# EAGLE design roboskin_distance_IMU_WIFI (EAGLE 9.4.2)
COMPANY: ADAFRUIT INDUSTRIES; DRAWN: KTOWN; REV: B
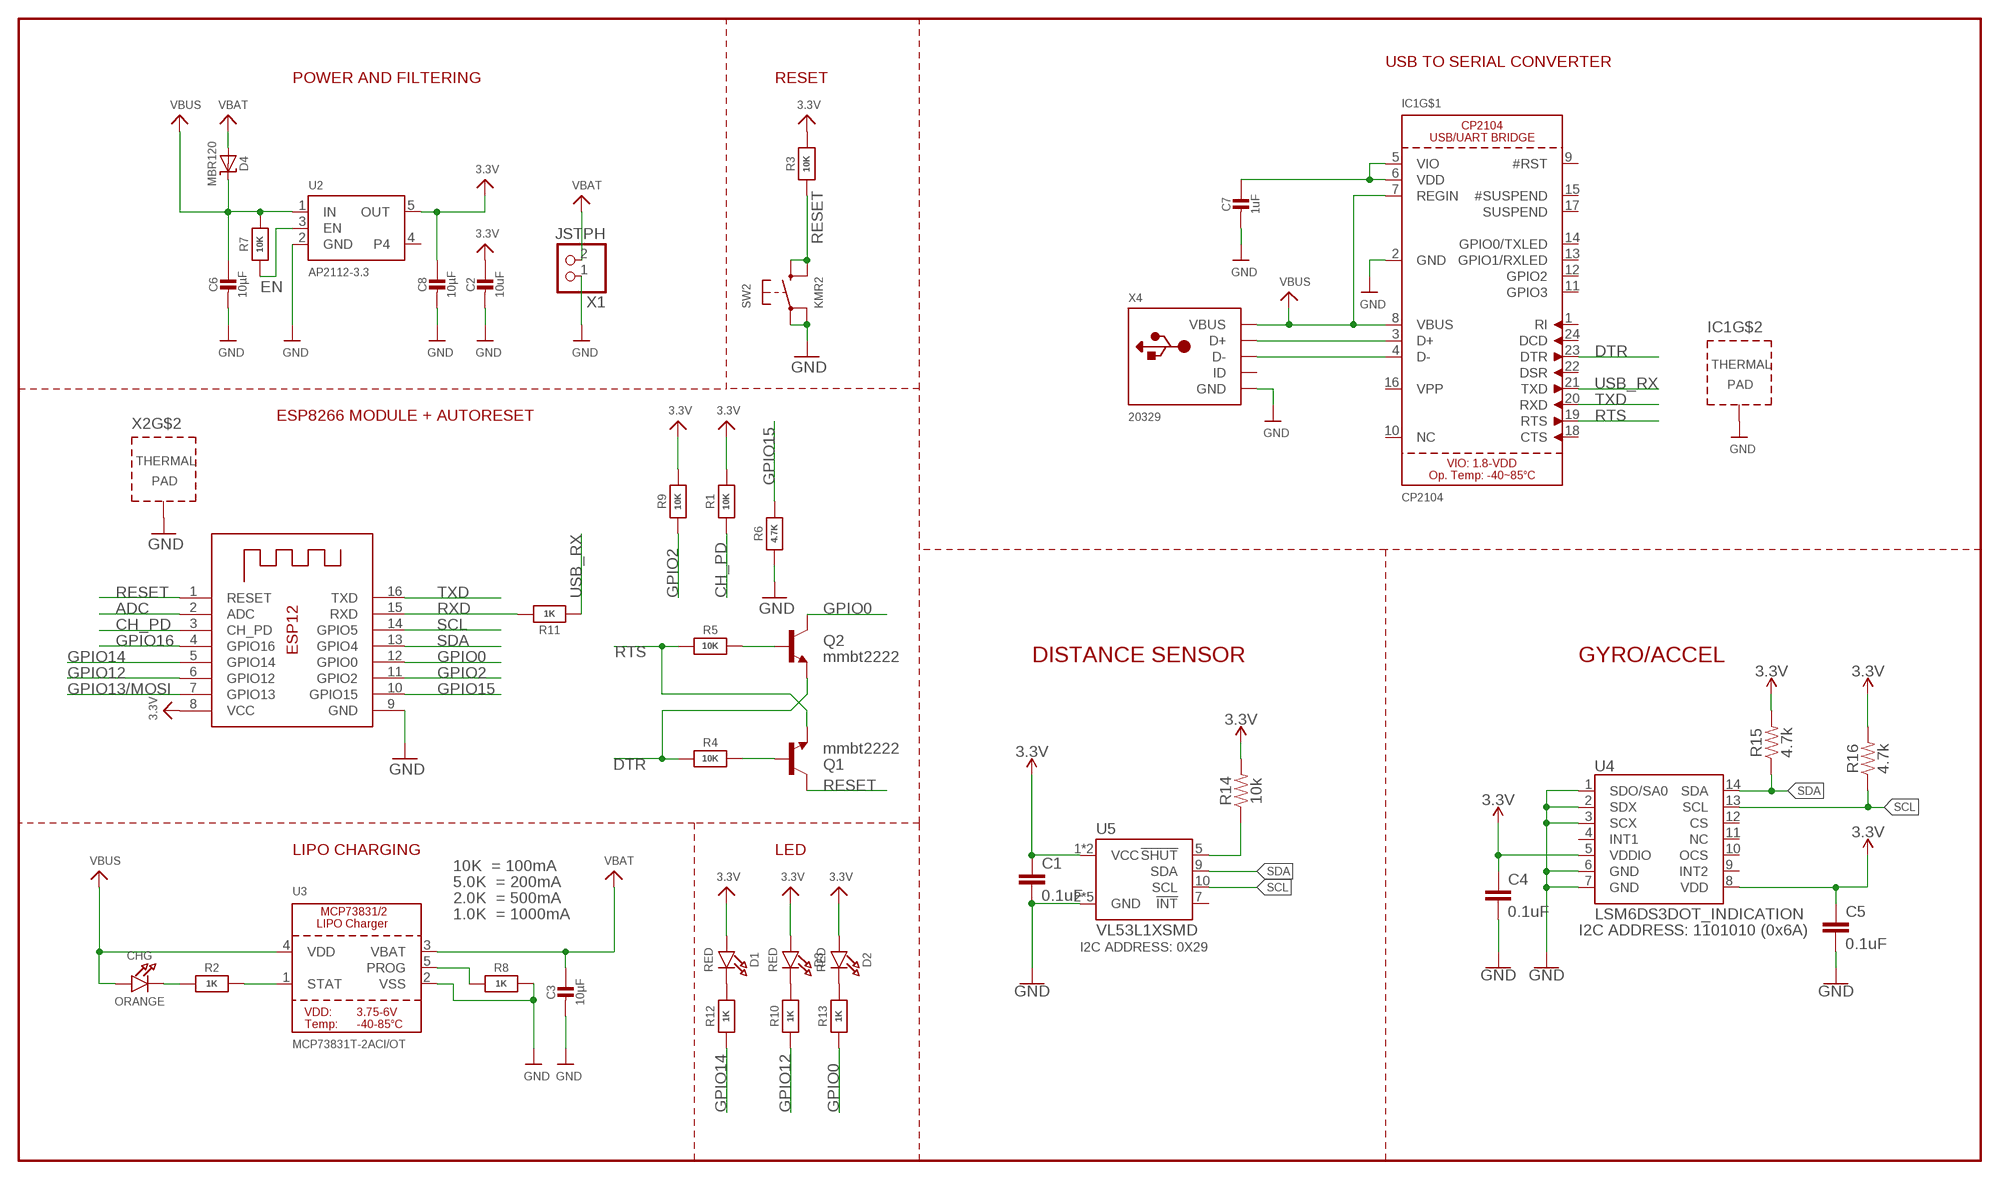
[diagram p0: schematic, sheet 1]

## Parts
C1  0.1uF  0.1UF-0603-25V-(+80/-20%)  [0603]
C2  10uF  CAP_CERAMIC0805-NOOUTLINE  [0805-NO]
C3  10µF  CAP_CERAMIC0805-NOOUTLINE  [0805-NO]
C4  0.1uF  0.1UF-0603-25V-(+80/-20%)  [0603]
C5  0.1uF  0.1UF-0603-25V-(+80/-20%)  [0603]
C6  10µF  CAP_CERAMIC0805-NOOUTLINE  [0805-NO]
C7  1uF  CAP_CERAMIC0603_NO  [0603-NO]
C8  10µF  CAP_CERAMIC0805-NOOUTLINE  [0805-NO]
CHG  ORANGE  LED0805_NOOUTLINE  [CHIPLED_0805_NOOUTLINE]
D1  RED  LED0805_NOOUTLINE  [CHIPLED_0805_NOOUTLINE]
D2  RED  LED0805_NOOUTLINE  [CHIPLED_0805_NOOUTLINE]
D3  RED  LED0805_NOOUTLINE  [CHIPLED_0805_NOOUTLINE]
D4  MBR120  DIODE-SCHOTTKYSOD-123  [SOD-123]
IC1  CP2104  [QFN24_4MM_SMSC]
Q1  mmbt2222  TRANSISTOR_NPNSOT23-3  [SOT23-3]
Q2  mmbt2222  TRANSISTOR_NPNSOT23-3  [SOT23-3]
R1  10K  RESISTOR_0603_NOOUT  [0603-NO]
R2  1K  RESISTOR_0603_NOOUT  [0603-NO]
R3  10K  RESISTOR_0603_NOOUT  [0603-NO]
R4  10K  RESISTOR_0603_NOOUT  [0603-NO]
R5  10K  RESISTOR_0603_NOOUT  [0603-NO]
R6  4.7K  RESISTOR_0603_NOOUT  [0603-NO]
R7  10K  RESISTOR_0603_NOOUT  [0603-NO]
R8  1K  RESISTOR_0603_NOOUT  [0603-NO]
R9  10K  RESISTOR_0603_NOOUT  [0603-NO]
R10  1K  RESISTOR_0603_NOOUT  [0603-NO]
R11  1K  RESISTOR_0603MP  [_0603MP]
R12  1K  RESISTOR_0603_NOOUT  [0603-NO]
R13  1K  RESISTOR_0603_NOOUT  [0603-NO]
R14  10k  10KOHM-0603-1/10W-1%  [0603]
R15  4.7k  4.7KOHM-0603-1/10W-1%  [0603]
R16  4.7k  4.7KOHM-0603-1/10W-1%  [0603]
SW2  KMR2  SWITCH_TACT_SMT4.6X2.8  [BTN_KMR2_4.6X2.8]
U2  AP2112-3.3  VREG_SOT23-5  [SOT23-5]
U3  MCP73831T-2ACI/OT  MCP73831/2  [SOT23-5]
U4  LSM6DS3DOT_INDICATION  [LGA14L_DOT_INDICATOR]
U5  VL53L1XSMD  [VL53L1X]
X1  JSTPH  CON_JST_PH_2PIN  [JSTPH2]
X2  ESP-12  ESP-12S  [ESP-12S]
X4  20329  USB_MICRO_20329_V2  [4UCONN_20329_V2]

## Nets
3.3V: C1.1 C2.1 C4.1 C8.1 D1.A D2.A D3.A R1.2 R3.2 R9.2 R14.2 R15.2 R16.2 U2.5(OUT) U4.5(VDDIO) U5.1(VCC) U5.11(VCC) X2.8(VCC)
ADC: X2.2(ADC)
CH_PD: R1.1 X2.3(CH_PD)
DTR: IC1.23(DTR) Q2.2(E) R4.1
EN: R7.1 U2.3(EN)
GND: C1.2 C2.2 C3.2 C4.2 C5.2 C6.2 C7.2 C8.2 IC1.2(GND) IC1.THERM(TP) R6.1 R8.2 SW2.A'(P1) SW2.A(P) U2.2(GND) U3.2(VSS) U4.1(SDO/SA0) U4.2(SDX) U4.3(SCX) U4.6(GND) U4.7(GND) U5.2(GND) U5.3(GND) U5.4(GND) U5.6(GND) U5.12(GND) X1.1 X2.9(GND) X2.P$1(TP) X4.BASE@1(GND) X4.BASE@2(GND) X4.GND X4.SPRT@1(GND) X4.SPRT@2(GND) X4.SPRT@3(GND) X4.SPRT@4(GND)
GPIO0: Q2.3(C) R13.1 X2.12(GPIO0)
GPIO2: R9.1 X2.11(GPIO2)
GPIO12: R10.1 X2.6(GPIO12)
GPIO13/MOSI: X2.7(GPIO13)
GPIO14: R12.1 X2.5(GPIO14)
GPIO15: R6.2 X2.10(GPIO15)
GPIO16: X2.4(GPIO16)
N$1: CHG.C R2.1
N$2: IC1.3(D+) X4.D+
N$3: R2.2 U3.1(STAT)
N$4: R8.1 U3.5(PROG)
N$5: D3.C R10.2
N$6: IC1.4(D-) X4.D-
N$8: C7.1 IC1.5(VIO) IC1.6(VDD)
N$9: D1.C R12.2
N$10: D2.C R13.2
N$11: R14.1 U5.5(!SHUT)
N$12: Q1.1(B) R4.2
N$13: Q2.1(B) R5.2
N$14: C5.1 U4.8(VDD) ; supply symbol labelled 3.3V
RESET: Q1.3(C) R3.1 SW2.B'(S1) SW2.B(S) X2.1(RESET)
RTS: IC1.19(RTS) Q1.2(E) R5.1
RXD: R11.2 X2.15(RXD)
SCL: R16.1 U4.13(SCL) U5.10(SCL) X2.14(GPIO5)
SDA: R15.1 U4.14(SDA) U5.9(SDA) X2.13(GPIO4)
TXD: IC1.20(RXD) X2.16(TXD)
USB_RX: IC1.21(TXD) R11.1
VBAT: C3.1 D4.A U3.3(VBAT) X1.2
VBUS: C6.1 CHG.A D4.C IC1.7(REGIN) IC1.8(VBUS) R7.2 U2.1(IN) U3.4(VDD) X4.VBUS
Unconnected: IC1.1(RI) IC1.9(#RST) IC1.10(NC) IC1.11(GPIO3) IC1.12(GPIO2) IC1.13(GPIO1/RXLED) IC1.14(GPIO0/TXLED) IC1.15(#SUSPEND) IC1.16(VPP) IC1.17(SUSPEND) IC1.18(CTS) IC1.22(DSR) IC1.24(DCD) U2.4 U4.4(INT1) U4.9(INT2) U4.10(OCS) U4.11(NC) U4.12(CS) U5.7(!INT) X4.ID

## Notes on the sheet
- USB TO SERIAL CONVERTER
- POWER AND FILTERING | RESET
- ESP8266 MODULE + AUTORESET
- DISTANCE SENSOR | GYRO/ACCEL
- LIPO CHARGING | LED
- 10K  = 100mA
- 5.0K  = 200mA
- 2.0K  = 500mA
- 1.0K  = 1000mA
- I2C ADDRESS: 1101010 (0x6A)
- I2C ADDRESS: 0X29

## Library data of the parts
C1 C4 C5 = SparkFun-Capacitors:0.1UF: 0.1µF ceramic capacitors A capacitor is a passive two-terminal electrical component used to store electrical energy temporarily in an electric field.; PROD_ID: CAP-00810
C2 C3 C6-C8 = microbuilder:CAP_CERAMIC: Ceramic Capacitors For new designs, use the packages preceded by an '_' character since they are more reliable: The following footprints should be used on most boards: _0402 - Standard footprint for regular board layouts _0603 - Standard footprint for regular board layouts _0805 - Standard footprint for regular board layouts _1206 - Standard footprint for regular board layouts For extremely tight-pitch boards where space is at a premium, the following 'micro-pitch' footprints can be used (smaller pads, no silkscreen outline, etc.): _0402MP - Micro-pitch footprint for very dense/compact boards _0603MP - Micro-pitch footprint for very dense/compact boards _0805MP - Micro-pitch footprint for very dense/compact boards _1206MP - Micro-pitch footprint for very dense/compact boards
CHG D1-D3 = microbuilder:LED: LED 0603 - 0603 Surface Mount Package 2mA: Green LED - Low Power (3.9mcd, 2ma, 1.7Vf) - Digikey: 475-2709-2-ND Orange LED - Low Power (9.8mcd, 2ma, 1.8Vf) - Digikey: 475-1194-2-ND Red LED - Low Power (5mcd, 2ma, 1.8Vf) - Digikey: 475-1195-2-ND Yellow LED - Low Power (7mcd, 2ma, 1.8Vf) - Digikey: 475-1196-2-ND 5mA: Blue LED - Low Power (17mcd, 5ma, 2.9Vf) - Digikey: LNJ937W8CRACT-ND 0805 - 0805 Surface Mount Package 2mA: Red LED (8.8mcd, 2mA, 1.8Vf, Clear) - Low Power [Digikey: 475-2510-1-ND] Green LED (5mcd, 2mA, 1.8Vf, Clear) - Low Power [Digikey: 475-2730-1-ND] Yellow LED (11.3mcd, 2mA, 1.8Vf, Clear) - Low Power [Digikey: 475-2555-1-ND] 20mA: Red LED (104mcd, 20mA, Diffused) - LS R976 [Digikey: 475-1278-6-ND] Red LED (12mcd, 20mA, 2.0Vf, Clear) - APT2012EC [Digikey: 754-1128-1-ND] Green LED (15mcd, 20mA, 2.2Vf, Clear) - APT2012GC [Digikey: 754-1131-1-ND] Orange LED (160mcd, 20mA, 2.1Vf, Clear) - APT2012SECK [Digikey: 754-1130-1-ND] 1206 - 1206 Surface Mount Package Green LED (26mcd, 20mA, Diffused) - LG N971 [Digikey: 475-1407-6-ND] Red LED (15mcd, 20mA, Diffused) - LH N974 [Digikey: 475-1416-6-ND] Cree - Cree High-Power Surface Mount LEDs XPEBWT-L1-0000-00D50 - White 111lm 350mA 2.9Vf 6200K 110° XTEAWT-00-0000-00000LEE3 - White 114lm 350mA 2.85Vf 5000K 115° Everlight - Everlight 45-21 Series Surface Mount LEDs 45-21/QK2C-B2832AC2CB2/2T - Warm White 2000mcd 20mA 3.25Vf 3050K 120° 45-21/LK2C-B38452C4CB2/2T - Nuetral White 2000mcd 20mA 3.25Vf 4150K 120° 45-21/LK2C-B50634C6CB2/2T - Cold White 2200mcd 20mA 3.25Vf 5650K 120° PLCC2 Reverse Mount LS T77K-J1L2-1-0-2-R18-Z - Red 11.25mcd 2mA 1.8Vf 630nm 120° LO T77K-L1M2-24-Z - Orange 19.6mcd 2mA 1.8Vf 606nm 120° LY T77K-K2M1-26-Z - Yellow 15.7mcd 2mA 1.8Vf 587nm 120°
D4 = microbuilder:DIODE-SCHOTTKY
IC1 = microbuilder:CP2104: CP2104 - USB to UART Bridge VDD Output: 3.45V
Q1 Q2 = SparkFun:TRANSISTOR_NPN: Transistor NPN BJT configuration in SOT23 package. MMBT2222 is the common NPN we use. Double check BCE configuration again layout.
R1-R13 = microbuilder:RESISTOR: Resistors For new designs, use the packages preceded by an '_' character since they are more reliable: The following footprints should be used on most boards: _0402 - Standard footprint for regular board layouts _0603 - Standard footprint for regular board layouts _0805 - Standard footprint for regular board layouts _1206 - Standard footprint for regular board layouts For extremely tight-pitch boards where space is at a premium, the following 'micro-pitch' footprints can be used (smaller pads, no silkscreen outline, etc.): _0402MP - Micro-pitch footprint for very dense/compact boards _0603MP - Micro-pitch footprint for very dense/compact boards _0805MP - Micro-pitch footprint for very dense/compact boards _1206MP - Micro-pitch footprint for very dense/compact boards
R14 = SparkFun-Resistors:10KOHM: 10kΩ resistor A resistor is a passive two-terminal electrical component that implements electrical resistance as a circuit element. Resistors act to reduce current flow, and, at the same time, act to lower voltage levels within circuits. - Wikipedia; PROD_ID: RES-00824
R15 R16 = SparkFun-Resistors:4.7KOHM: 4.7kΩ resistor A resistor is a passive two-terminal electrical component that implements electrical resistance as a circuit element. Resistors act to reduce current flow, and, at the same time, act to lower voltage levels within circuits. - Wikipedia; PROD_ID: RES-07857
SW2 = microbuilder:SWITCH_TACT_SMT: SMT Tact Switches 6x6mm - Digikey: P12940SCT-ND KMR2 (4.6x2.8mm) - Digikey: 401-1426-1-ND EVQ-PQHB55 - Light Touch, 160GF (4.5x4.5mm) - Digikey: P8090SCT-ND KMT0 - KMT021 NGJ LHS (etc.) IP68/Waterproof - Digikey: CKN10289CT-ND
U2 = microbuilder:VREG_SOT23-5: SOT23-5 Fixed Voltage Regulators Part Current Out V Out V In V Dropout θJA (°C/W) TJ (°C) Digikey Part No. ADP121 150mA 3.3V 3.4-5.5V 0.09V @ 150mA -- -- ADP121-AUJZ33R7CT-ND ADP121 150mA 3.0V 3.1-5.5V 0.09V @ 150mA -- -- ADP121-AUJZ30R7CT-ND ADP122 300mA 3.3V 3.4-5.5V 0.085V @ 300mA -- -- ADP122AUJZ-3.3-R7CT-ND ADP1712 300mA 3.3V 3.5-5.5V 0.17V @ 300mA -- -- ADP1712AUJZ-3.3-R7TR-ND AP7311 (Low Cost) 150mA 3.3V 3.5-6V 0.15V @ 150mA -- -- AP7311-33WG-7DICT-ND LD39015M18R 150mA 1.8V 1.9V-5.5V 0.08V @ 100mA -- -- 497-6977-1-ND LP2985A-33DBVR 150mA 3.3V 3.3-16V 0.28V @ 150mA 206 150 296-18479-1-ND MCP1824T-3302E/OT 300mA 3.3V 3.5V-6V 0.2V @ 300mA -- -- MCP1824T-3302E/OTCT-ND MIC5205-2.5YM5 TR 150mA 2.5V 2.7-16V 0.165V @ 150mA -- -- 576-1257-2-ND MIC5205-3.0YM5 TR 150mA 3.0V 3.2V-16V 0.165V @ 150mA -- -- 576-1258-2-ND MIC5205-3.3YM5 TR 150mA 3.3V 3.5V-16V 0.165V @ 150mA -- -- 576-1259-2-ND TPS780330220 150mA 3.3V+2.2V 3.6-5.5V 250mV Max -- -- 296-23332-1-ND TDA3663/N1,135 100mA 3.3V 3.5-45V 0.18V @ 50mA -- -- 568-5343-1-ND Max operating temp can be calculated using θJA, TJ (max junction temperature), and power in watts. Set the "Maximum Ambient Temperature" until it reaches TJ ("Max Junction Temperature"), which is the absolute limit for safe use of the regulator: Heat Sink Temperature Calculator <http://www.daycounter.com/Calculators/Heat-Sink-Temperature-Calculator.phtml> For example, With 12V source into a 3.3V LP2985 and a 30mA load, we are dissipating (12V-3.3V) * 0.03A = 0.261W. With a θJA of 206 °C/W, a TJ of 150°C, and 261mW we can safely use the chip without a heat sink up to 75°C (=147.1°C Junction Temperature).
U3 = microbuilder:MCP73831/2: MCP73831/2 LIPO Charger VDD: 3.75 - 6V Temp -40 - 85°C Programmable Charge Rate: 15-500mA NOTE: STAT is a tri-state logic output on the MCP73831 and an open-drain output on the MCP73832. SOT23-5 with 4.2V output and tri-state logic on STAT = MCP73831T-2ACI/OT
U4 = LSM6DS3:LSM6DS3; PROD_ID: IC-12969
U5 = SparkFun-Sensors:VL53L1X: STMicroelectronics VL53L1X - 400 cm IR Laser ToF Sensor VL53L1X is a state-of-the-art ToF laser-ranging sensor, enhancing the ST FlightSense product family. It is the fastest miniature ToF sensor currently on the market with accurate ranging up to 4 m and fast ranging frequency (up to 50 Hz). Housed in a miniature and reflowable package, it integrates a single photon avalanche diode (SPAD) receiving array, a 940 nm invisible laser Class 1 emitter, physical infrared filters, and optics to achieve the best ranging performance in various ambient lighting conditions with a range of cover window options.; PROD_ID: IC-13960
X1 = microbuilder:CON_JST_PH_2PIN: JST 2-Pin Right-Angle Connector PH-Series - 4UConnector: 17311 SH-Series - 4UConnector: 07278
X2 = microbuilder:ESP-12S
X4 = microbuilder:USB: USB Connectors USBMINIB - Surface Mount Female Mini-B USB Connector 4UConnector: 06564

## Board
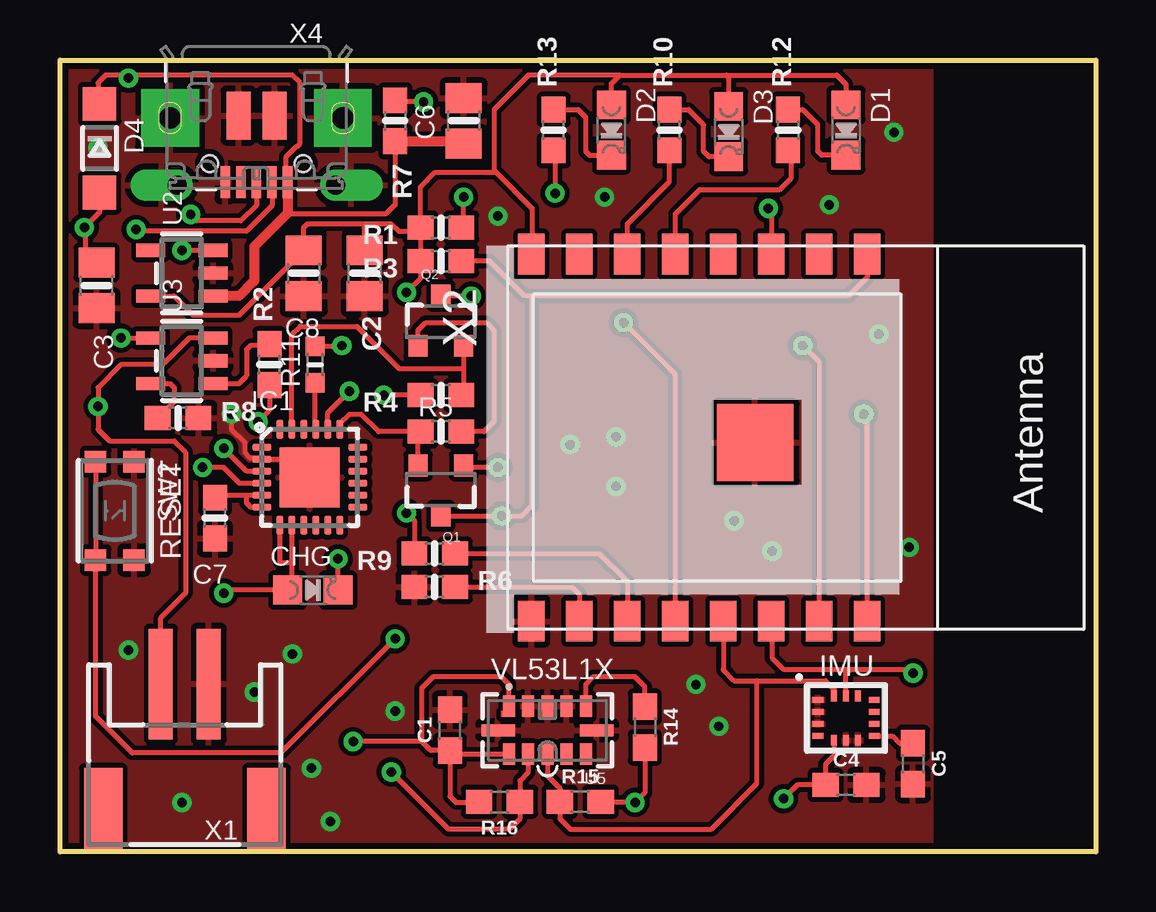
[diagram p1: board, top side]
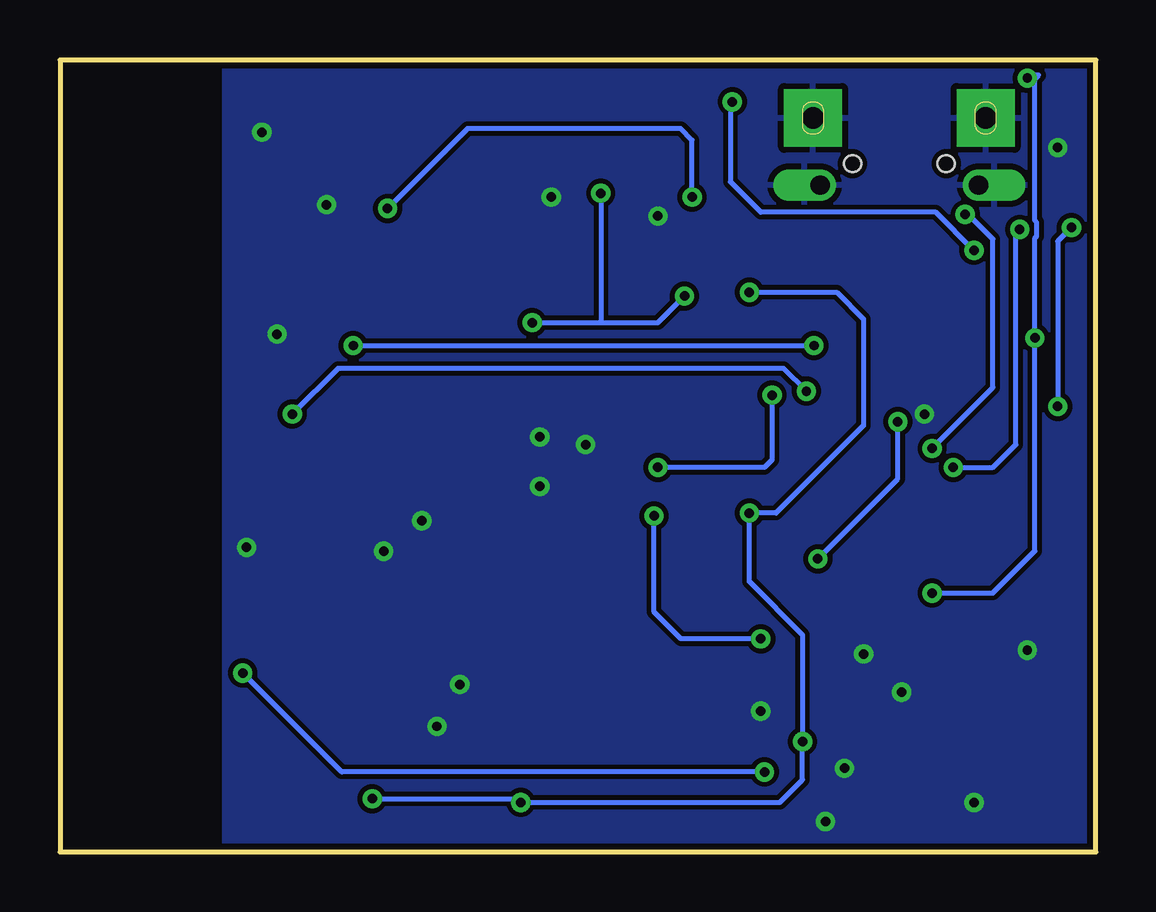
[diagram p2: board, bottom side, seen from below]

Size 43.18 x 33.02 mm. Coordinates in mm from the lower left corner, seen from the top.
Outline: 0,0 0,33.02 43.18,33.02 43.18,0 0,0
Copper layers (1*16): Top 0.035mm / dielectric 1.5mm / Bottom 0.035mm
Design rules "adafruit *": minimum track width 8mil, minimum drill 15.5mil, track to track 8mil, track to pad 8mil, pad to pad 8mil, via to via 8mil, smd to smd 8mil, copper to edge 10mil, drill to drill 8mil, minimum pad ring 10mil, minimum via ring 8mil, stop-mask expansion 2mil, vias tented up to drill 20mil, thermal gap 10mil
Holes 2.2 mm at 19.05,-33.72 19.05,-14.61

### Footprints (pad centres in the part's own frame; a part is rotated, then mirrored left to right if it is on the bottom)
0603 = smd 1.1 x 1: 1 -0.85,0; 2 0.85,0
0805-NO = smd 1.24 x 1.5: 1 -0.95,0; 2 0.95,0
0603-NO = smd 1.075 x 1: 1 -0.85,0; 2 0.85,0
CHIPLED_0805_NOOUTLINE = smd 1.2 x 1.2: A 0,-1.05; C 0,1.05
SOD-123 = smd 1.4 x 1.4: A 1.85,0; C -1.85,0
QFN24_4MM_SMSC = smd 0.8 x 0.28: 1 -2,1.25; 2 -2,0.75; 3 -2,0.25; 4 -2,-0.25; 5 -2,-0.75; 6 -2,-1.25; 13 2,-1.25; 14 2,-0.75; 15 2,-0.25; 16 2,0.25; 17 2,0.75; 18 2,1.25 | smd 0.28 x 0.8: 7 -1.25,-2; 8 -0.75,-2; 9 -0.25,-2; 10 0.25,-2; 11 0.75,-2; 12 1.25,-2; 19 1.25,2; 20 0.75,2; 21 0.25,2; 22 -0.25,2; 23 -0.75,2; 24 -1.25,2 | smd 2.5 x 2.5: THERM 0,0
SOT23-3 = smd 0.8 x 0.9: 1 -0.95,-1; 2 0.95,-1; 3 0,1.1
_0603MP = smd 0.8 x 0.8: 1 -0.762,0; 2 0.762,0
BTN_KMR2_4.6X2.8 = smd 0.9 x 0.9: A 2.05,0.8; A' -2.05,0.8; B 2.05,-0.8; B' -2.05,-0.8
SOT23-5 = smd 0.55 x 1.2: 1 -0.95,-1.3; 2 0,-1.3; 3 0.95,-1.3; 4 0.95,1.3; 5 -0.95,1.3
LGA14L_DOT_INDICATOR = smd 0.45 x 0.25: 1 -1.175,0.75; 2 -1.175,0.25; 3 -1.175,-0.25; 4 -1.175,-0.75; 8 1.175,-0.75; 9 1.175,-0.25; 10 1.175,0.25; 11 1.175,0.75 | smd 0.25 x 0.45: 5 -0.5,-0.925; 6 0,-0.925; 7 0.5,-0.925; 12 0.5,0.925; 13 0,0.925; 14 -0.5,0.925
VL53L1X = smd 0.5 x 0.9: 1 1.6,-1; 2 0.8,-1; 3 0,-1; 4 -0.8,-1; 5 -1.6,-1; 7 -1.6,1; 8 -0.8,1; 9 0,1; 10 0.8,1; 11 1.6,1 | smd 1.4 x 0.5: 6 -2.05,0; 12 2.05,0
JSTPH2 = smd 1 x 4.6: 1 -1,-3.7; 2 1,-3.7 | smd 1.6 x 3.4: NC1 -3.4,1.5; NC2 3.4,1.5
ESP-12S = smd 1.7 x 1.1: 1 -7.65,5.77; 2 -7.65,3.77; 3 -7.65,1.77; 4 -7.65,-0.23; 5 -7.65,-2.23; 6 -7.65,-4.23; 7 -7.65,-6.23; 8 -7.65,-8.23; 9 7.65,-8.23; 10 7.65,-6.23; 11 7.65,-4.23; 12 7.65,-2.23; 13 7.65,-0.23; 14 7.65,1.77; 15 7.65,3.77; 16 7.65,5.77 | smd 3.2 x 3.2: P$1 0.2,1.1
4UCONN_20329_V2 = smd 1 x 2: BASE@1 -0.75,-2; BASE@2 0.75,-2 | smd 0.4 x 1.35: D+ 0,0.775; D- -0.65,0.775; GND 1.3,0.775; ID 0.65,0.775; VBUS -1.3,0.775 | drill 0.8 pad 1.143 offset: SPRT@1 -3.3,0.9; SPRT@2 3.3,0.9 | drill 0.9 pad 2.413 square: SPRT@3 -3.6,-1.9; SPRT@4 3.6,-1.9 | hole 0.7: -1.95,0; 1.95,0

### Placement (x,y rotation side)
C1  16.26,5.08 90 top
C2  12.7,24.13 270 top
C3  1.52,23.62 270 top
C4  32.77,2.79 0 top
C5  35.56,3.68 270 top
C6  16.83,30.48 90 top
C7  6.46,13.92 270 top
C8  10.16,24.13 270 top
CHG  10.54,10.92 270 top
D1  32.77,30.1 180 top
D2  22.99,30.1 180 top
D3  27.88,30.04 180 top
D4  1.65,29.34 270 top
IC1  10.41,15.62 0 top
Q1  15.88,15.11 180 top
Q2  15.88,22.1 0 top
R1  15.88,26.03 180 top
R2  8.73,20.32 90 top
R3  15.88,24.64 180 top
R4  15.88,19.05 180 top
R5  15.88,17.53 0 top
R6  15.62,11.05 0 top
R7  13.97,30.48 270 top
R8  4.92,18.1 0 top
R9  15.62,12.45 180 top
R10  25.4,30.1 90 top
R11  10.64,20.32 90 top
R12  30.35,30.1 90 top
R13  20.57,30.1 90 top
R14  24.38,5.21 270 top
R15  21.69,2.1 0 top
R16  18.32,2.1 180 top
SW2  2.29,14.22 270 top
U2  5.08,24.13 90 top
U3  5.08,20.48 90 top
U4  32.77,5.59 0 top
U5  20.32,5.08 180 top
X1  5.21,3.3 180 top
X2  27.88,17.27 270 top
X4  8.19,28.7 180 top

### Tracks (layer width: path | path; a pad name or v marks a point on that pad's centre or on a via)
3.3V  (via drill 0.39)
  Top 0.203: 16.26,4.13 C1.1 15.45,4.23 15.08,4.6 | 16.26,4.13 16.26,2.32 16.51,2.06 17.44,2.06 R16.2 | U5.11 16.3,4.08 16.26,4.13 | R14.2 24.38,2.48 v23.97,2.06 22.57,2.06 R15.2 | U4.5 32.27,4.01 31.92,3.66 C4.1 30.73,2.79 v30.16,2.22 | 15.02,25.88 R1.2 15.02,27.72 15.64,28.34 18.18,28.34 | 15.02,25.88 R3.2 15.02,23.91 v14.45,23.34 | 15.02,25.88 14.13,25.88 13.81,26.19 12.7,26.19 | 12.7,26.19 10.32,26.19 10.16,26.03 C8.1 7.46,22.38 5.56,22.38 4.76,23.18 U2.5 | C2.1 12.7,26.19 | D2.A 22.99,32.04 23.34,32.38 | D1.A 32.77,32 32.38,32.38 27.78,32.38 | 23.34,32.38 27.78,32.38 | D3.A 27.88,32.29 27.78,32.38 | 23.34,32.38 19.53,32.38 18.1,30.96 18.1,28.42 18.18,28.34 | 18.18,28.34 19.69,26.83 19.69,24.96 X2.8 | v14.45,14.13 14.77,13.8 R9.2 | U5.1 18.72,7 18.41,7.3 15.56,7.3 15.08,6.83 15.08,4.6 | 15.08,4.6 v12.22,4.6
  Bottom 0.203: v30.16,2.22 24.13,2.22 v23.97,2.06 13.18,2.06 12.22,3.02 v12.22,4.6 12.22,9.05 14.45,11.27 v14.45,14.13 13.34,14.13 9.68,17.78 9.68,22.22 10.8,23.34 v14.45,23.34
CH_PD  (via drill 0.39)
  Top 0.203: R1.1 16.83,26.14 v16.83,27.3 | v29.53,26.83 29.65,26.71 X2.3
  Bottom 0.203: v16.83,27.3 16.83,29.69 17.3,30.16 26.19,30.16 v29.53,26.83
DTR
  Top 0.203: Q2.2 16.82,20.16 | 16.82,20.16 16.82,19.15 R4.1 | IC1.23 9.66,21.57 10,21.91 12.38,21.91 14.13,20.16 16.82,20.16
EN  (via drill 0.39)
  Top 0.203: U2.3 5.24,25.08 v5.08,25.08 | v15.16,31.27 14.03,31.27 R7.1
  Bottom 0.203: v5.08,25.08 6.67,26.67 13.97,26.67 15.24,27.94 15.24,31.19 v15.16,31.27
GND  (via drill 0.39)
  Top 0.203: IC1.THERM 9.66,16.37 IC1.2 8.36,16.43 7.93,16.43 7.71,16.65 7.71,17.08 7.14,17.64 v7.14,18.26
  other vias: 1.59,29.37 8.1,6.67 9.68,8.25 13.97,5.87 10.48,3.49 5.08,2.06 2.86,8.41 23.18,17.3 23.18,15.24 28.1,13.81 34.13,21.59 27.46,5.24 26.51,6.98 11.27,1.27 22.7,27.3 18.26,26.51 34.77,30 32.07,26.99 21.27,16.99 35.4,12.7 29.69,12.54
  pour Top: 0,0 36.35,0 36.35,33.02 0,33.02
  pour Bottom: 0,0 0,33.02 36.35,33.02 36.35,0
GPIO0  (via drill 0.39)
  Top 0.203: X2.12 25.65,19.91 v23.49,22.07 | v17.14,23.18 15.89,23.18 Q2.3 | R13.1 20.64,29.19 v20.64,27.46
  Bottom 0.203: v23.49,22.07 20.64,22.07 | 20.64,22.07 18.26,22.07 v17.14,23.18 | v20.64,27.46 20.64,22.07
GPIO2
  Top 0.203: R9.1 22.48,12.45 23.65,11.27 X2.11
GPIO12
  Top 0.203: X2.6 23.65,26.19 25.4,27.94 R10.1
GPIO14
  Top 0.203: X2.5 25.65,26.6 26.67,27.62 30,27.62 30.48,28.1 30.48,29.12 R12.1
GPIO15
  Top 0.203: R6.2 21.34,11.05 21.65,10.74 X2.10
N$1  (via drill 0.39)
  Top 0.203: CHG.C v11.59,12.22 | R2.1 8.73,18.41 v8.26,17.94
  Bottom 0.203: v11.59,12.22 8.26,15.56 v8.26,17.94
N$2  (via drill 0.39)
  Top 0.203: X4.D+ 8.19,26.95 7.55,26.31 5.72,26.31 v5.45,26.58 | IC1.3 7.78,15.87 v6.83,16.83
  Bottom 0.203: v5.45,26.58 5.31,26.58 4.29,25.56 4.29,19.37 v6.83,16.83
N$3
  Top 0.203: U3.1 7.46,19.53 7.78,19.84 7.78,20.95 7.94,21.11 8.67,21.11 R2.2 8.52,20.95
N$4
  Top 0.203: U3.5 4.6,19.53 4.76,19.37 4.76,18.79 R8.1
N$5
  Top 0.203: R10.2 26.2,30.95 26.83,30.32 26.83,29.21 27.05,28.99 D3.C
N$6  (via drill 0.39)
  Top 0.203: X4.D- 8.84,26.94 7.78,25.88 3.17,25.88 v3.17,25.96 | v5.94,16.03 6.83,16.03 7.49,15.37 IC1.4
  Bottom 0.203: 6.03,16.03 v5.94,16.03 4.29,16.03 3.33,16.99 3.33,25.8 v3.17,25.96 3.17,25.88
N$8
  Top 0.203: IC1.5 7.78,14.87 | 7.78,14.87 6.56,14.87 C7.1 | IC1.6 7.96,14.37 7.78,14.55 7.78,14.87
N$9
  Top 0.203: R12.2 30.96,30.95 31.59,30.32 31.59,29.21 31.75,29.05 D1.C
N$10
  Top 0.203: R13.2 21.6,30.95 21.91,30.64 21.91,29.21 22.07,29.05 D2.C
N$11
  Top 0.203: U5.5 21.92,7 22.23,7.3 23.97,7.3 24.38,6.89 R14.1
N$12  (via drill 0.39)
  Top 0.203: R4.2 v13.49,19.05 | v18.26,16.03 16.9,16.03 Q1.1
  Bottom 0.203: v13.49,19.05 13.49,16.35 13.81,16.03 v18.26,16.03
N$13
  Top 0.203: Q2.1 14.92,21.75 15.24,22.07 17.78,22.07 18.1,21.75 18.1,17.94 17.69,17.53 R5.2
N$14
  Top 0.203: U4.8 34.69,4.84 35,4.53 C5.1
RESET  (via drill 0.39)
  Top 0.203: SW2.B' SW2.B 1.49,5.66 3.02,4.13 9.21,4.13 v13.97,8.89 | X2.1 33.65,23.96 32.86,23.18 19.69,23.18 | 19.69,23.18 19.37,23.18 17.91,24.64 R3.1 | Q1.3 v18.41,14.01 19.25,14.01 19.69,14.45 19.69,23.18
  Bottom 0.203: v13.97,8.89 17.3,8.89 18.41,10 v18.41,14.01
RTS
  Top 0.203: R5.1 14.92,17.53 | 14.92,17.53 13.27,17.53 12.54,18.26 12.06,18.26 11.66,17.85 IC1.19 | Q1.2 14.92,17.52 14.92,17.53
RXD  (via drill 0.39)
  Top 0.203: X2.15 31.65,20.42 v30.96,21.11 | v11.75,21.11 11.72,21.08 R11.2
  Bottom 0.203: v30.96,21.11 v11.75,21.11
SCL  (via drill 0.39)
  Top 0.203: U5.10 19.52,3.33 19.17,2.98 R16.1 19.17,1.39 18.73,0.95 16.19,0.95 v13.81,3.33 | X2.14 29.69,9.58 29.69,8.1 30.16,7.62 32.86,7.62 | v35.56,7.46 35.4,7.62 32.86,7.62 | U4.13 32.77,7.52 32.86,7.62
  Bottom 0.203: v13.81,3.33 31.43,3.33 v35.56,7.46
SDA
  Top 0.203: U5.9 20.32,3.17 20.84,2.66 R15.1 20.84,1.39 21.27,0.95 27.15,0.95 29.05,2.86 29.05,7.14 | X2.13 27.65,7.6 28.1,7.14 29.05,7.14 | 29.05,7.14 31.91,7.14 32.27,6.79 U4.14
TXD  (via drill 0.39)
  Top 0.203: IC1.20 11.16,18.31 v12.06,19.21 | v33.5,18.26 33.65,18.11 X2.16
  Bottom 0.203: v12.06,19.21 13.02,20.16 31.59,20.16 v33.5,18.26
USB_RX
  Top 0.203: IC1.21 10.64,17.65 R11.1
VBAT  (via drill 0.39)
  Top 0.203: X1.2 4.21,9.76 5.24,10.79 5.24,16.67 4.76,17.14 2.06,17.14 1.59,17.62 v1.59,18.57 1.59,19.37 2.54,20.32 4.29,20.32 5.39,21.43 U3.3 6.03,21.43 | D4.A 1.65,26.67 1.06,26.08 | 1.06,26.08 v1.02,26.03 | C3.1 1.06,25.03 1.06,26.08
  Bottom 0.203: v1.02,26.03 1.59,25.46 v1.59,18.57
VBUS  (via drill 0.39)
  Top 0.203: IC1.8 9.66,12.06 | 9.66,12.06 9.66,11.09 CHG.A 6.95,10.92 v6.83,10.79 | IC1.7 9.16,12.11 9.21,12.06 9.66,12.06 | R7.2 13.97,26.99 13.58,26.6 9.53,26.6 9.49,26.64 | v2.54,21.43 U3.4 | X4.VBUS 9.49,28.35 9.44,28.41 9.44,28.99 9.85,29.41 9.88,29.41 10,29.53 10,32.07 9.68,32.38 2.86,32.38 | D4.C 1.59,31.25 1.59,32.07 1.9,32.38 2.86,32.38 | v2.86,32.26 2.86,32.38
  Top 0.406: R7.2 16.73,29.63 C6.1 | X4.VBUS 9.49,26.64 8.1,25.24 8.1,23.81 7.46,23.18 U2.1
  Bottom 0.203: v6.83,10.79 4.29,10.79 2.54,12.54 v2.54,21.43 2.54,25.6 2.47,25.67 2.47,26.25 2.54,26.32 2.54,32.23 2.38,32.38 2.74,32.38 v2.86,32.26

### Text on the board
tPlace: RESET | VL53L1X | IMU